# EAGLE schematic schematic (EAGLE 7.5.0)
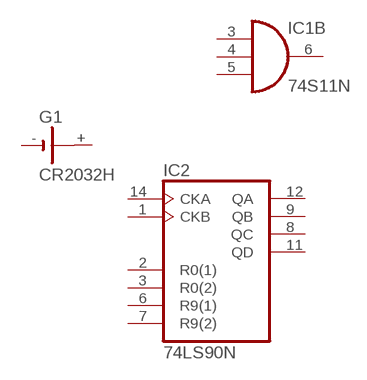
[diagram p0: schematic, sheet 1]

## Parts
G1  CR2032H  [CR2032H]
IC1  74S11N  [DIL14]
IC2  74LS90N  [DIL14]
Unconnected: G1.+ G1.+@1(+) G1.- IC1.1(A:I0) IC1.2(A:I1) IC1.3(B:I0) IC1.4(B:I1) IC1.5(B:I2) IC1.6(B:O) IC1.8(C:O) IC1.9(C:I0) IC1.10(C:I1) IC1.11(C:I2) IC1.12(A:O) IC1.13(A:I2) IC2.1(CKB) IC2.2(R0(1)) IC2.3(R0(2)) IC2.6(R9(1)) IC2.7(R9(2)) IC2.8(QC) IC2.9(QB) IC2.11(QD) IC2.12(QA) IC2.14(CKA)

## Power pins joined to a net without a drawn wire
GND: IC1.7(P:GND) IC2.10(GND)
VCC: IC1.14(P:VCC) IC2.5(VCC)

## Library data of the parts
G1 = battery:CR2032H: LI BATTERY Varta
IC1 = 74xx-eu:74*11: Triple 3-input AND gate
IC2 = 74xx-eu:74*90: Decade, divide by twelve and binary COUNTER